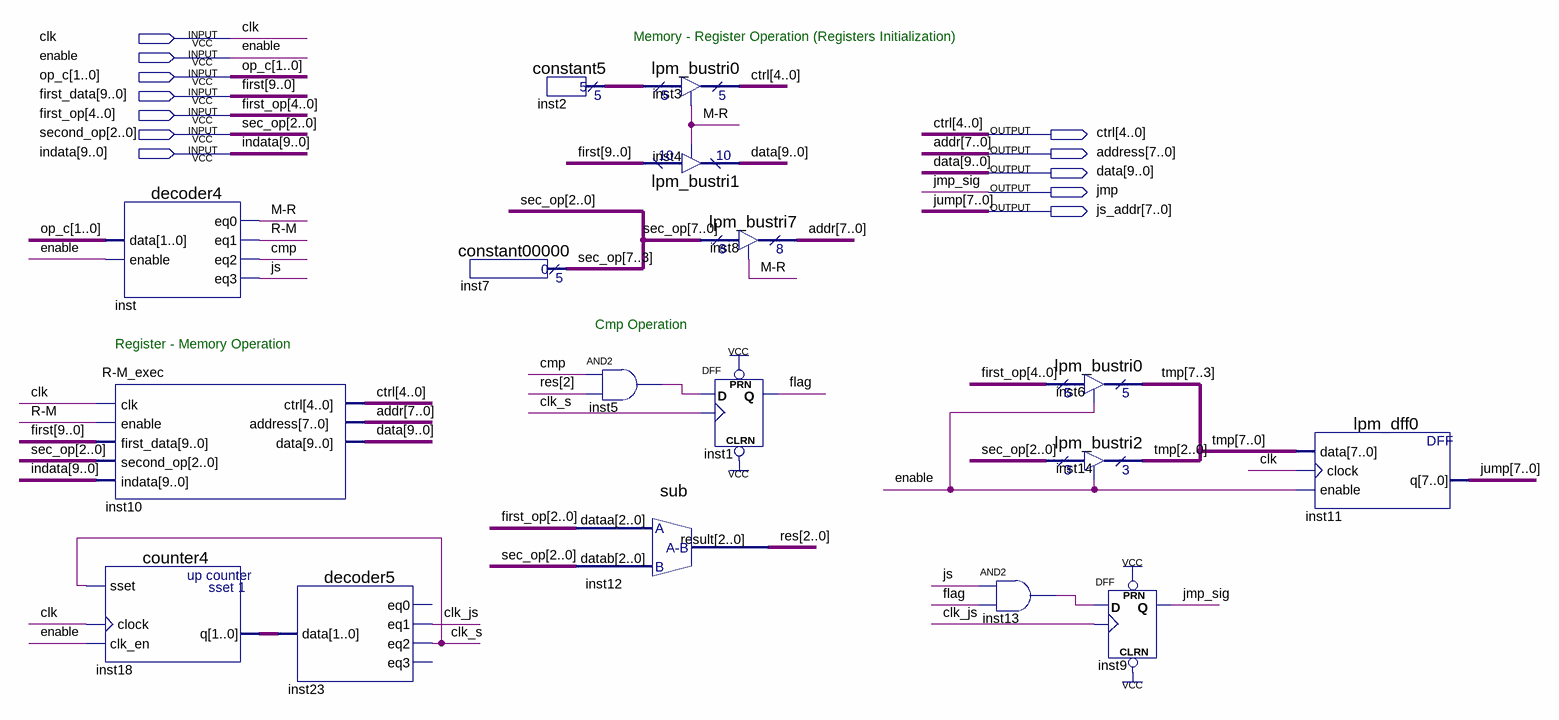
[diagram p0: schematic sheet]
// Quartus schematic execution.bdf as structural Verilog: 17 symbols, 12 pins
module execution (
  input  clk,
  input  enable,
  input  [1:0] op_c,
  input  [9:0] first_data,
  input  [4:0] first_op,
  input  [2:0] second_op,
  input  [9:0] indata,
  output [4:0] ctrl,
  output [7:0] address,
  output [9:0] data,
  output jmp,
  output [7:0] js_addr
);

  wire clk_js, clk_s, cmp, flag, inst5_out, inst13_out, js, \M-R , \R-M ;
  wire [1:0] inst18_q;
  wire [2:0] res;
  wire [4:0] inst2_result;
  wire [7:0] tmp;
  wire [7:3] sec_op;

  decoder4 inst (.data(op_c), .enable(enable), .eq0(\M-R ), .eq1(\R-M ), .eq2(cmp), .eq3(js));
  \R-M_exec  inst10 (
    .clk(clk), .enable(\R-M ), .first_data(first_data), .second_op(second_op), .indata(indata), .ctrl(ctrl),
    .address(address), .data(data));
  counter4 inst18 (.sset(clk_s), .clock(clk), .clk_en(enable), .q(inst18_q));
  decoder5 inst23 (.data(inst18_q), .eq1(clk_js), .eq2(clk_s));  // open: eq0, eq3
  constant00000 inst7 (.result(sec_op));
  constant5 inst2 (.result(inst2_result));
  and inst5 (inst5_out, cmp, res[2]);
  sub inst12 (.dataa(first_op[2:0]), .datab(second_op), .result(res));
  lpm_bustri0 inst3 (.enabledt(\M-R ), .data(inst2_result), .tridata(ctrl));
  lpm_bustri1 inst4 (.enabledt(\M-R ), .data(first_data), .tridata(data));
  lpm_bustri7 inst8 (.enabledt(\M-R ), .data({sec_op, second_op}), .tridata(address));
  DFF inst1 (.CLRN(1'b1), .CLK(clk_s), .D(inst5_out), .PRN(1'b1), .Q(flag));
  and inst13 (inst13_out, js, flag);
  lpm_bustri0 inst6 (.enabledt(enable), .data(first_op), .tridata(tmp[7:3]));
  lpm_bustri2 inst14 (.enabledt(enable), .data(second_op), .tridata(tmp[2:0]));
  DFF inst9 (.CLRN(1'b1), .CLK(clk_js), .D(inst13_out), .PRN(1'b1), .Q(jmp));
  lpm_dff0 inst11 (.data(tmp), .clock(clk), .enable(enable), .q(js_addr));

  // Other names for the same wires on the sheet: addr[7:0] = address; first[9:0] = first_data; jmp_sig = jmp;
  //   jump[7:0] = js_addr; sec_op[2:0] = second_op

  // Notes on the sheet:
  //   Memory - Register Operation (Registers Initialization)
  //   Cmp Operation
  //   Register - Memory Operation
endmodule
